# Altium schematic sheet MUX_Block.SchDoc
size A4; SheetNumber: 5; SheetTotal: 7
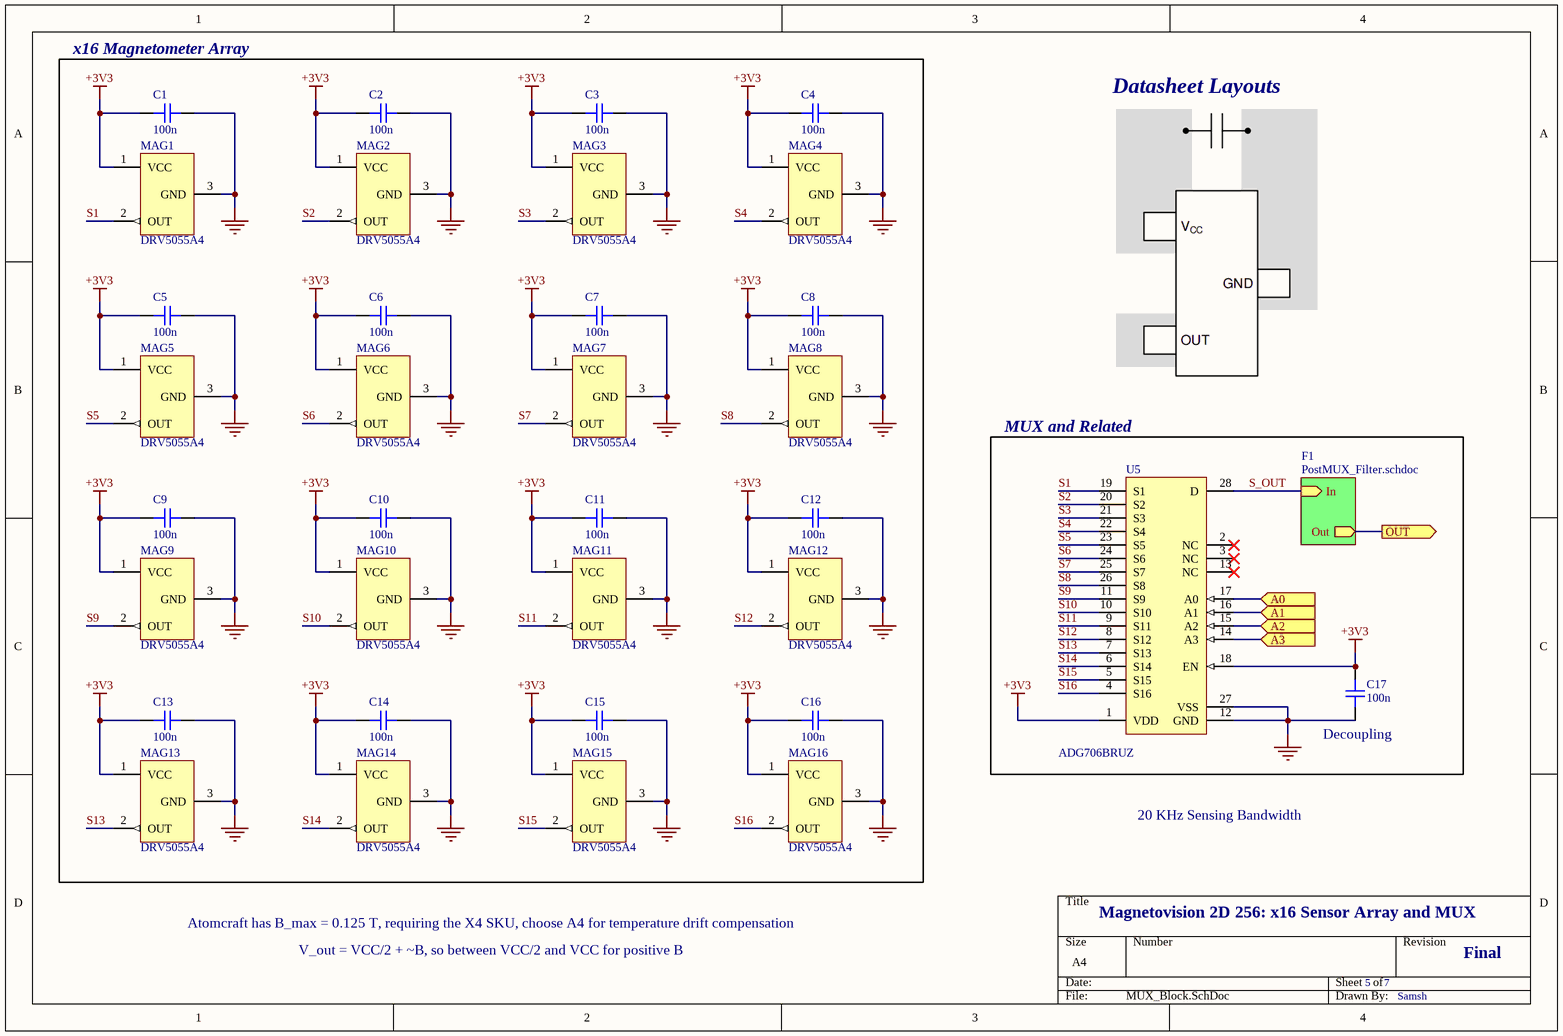
[diagram p0: MUX_Block.SchDoc]

## Parts
C1  100n  [CAP_0603]
C2  100n  [CAP_0603]
C3  100n  [CAP_0603]
C4  100n  [CAP_0603]
C5  100n  [CAP_0603]
C6  100n  [CAP_0603]
C7  100n  [CAP_0603]
C8  100n  [CAP_0603]
C9  100n  [CAP_0603]
C10  100n  [CAP_0603]
C11  100n  [CAP_0603]
C12  100n  [CAP_0603]
C13  100n  [CAP_0603]
C14  100n  [CAP_0603]
C15  100n  [CAP_0603]
C16  100n  [CAP_0603]
C17  100n  [CAP_0603]
MAG1  DRV5055A4  [SOT100P237X112-3N]
MAG2  DRV5055A4  [SOT100P237X112-3N]
MAG3  DRV5055A4  [SOT100P237X112-3N]
MAG4  DRV5055A4  [SOT100P237X112-3N]
MAG5  DRV5055A4  [SOT100P237X112-3N]
MAG6  DRV5055A4  [SOT100P237X112-3N]
MAG7  DRV5055A4  [SOT100P237X112-3N]
MAG8  DRV5055A4  [SOT100P237X112-3N]
MAG9  DRV5055A4  [SOT100P237X112-3N]
MAG10  DRV5055A4  [SOT100P237X112-3N]
MAG11  DRV5055A4  [SOT100P237X112-3N]
MAG12  DRV5055A4  [SOT100P237X112-3N]
MAG13  DRV5055A4  [SOT100P237X112-3N]
MAG14  DRV5055A4  [SOT100P237X112-3N]
MAG15  DRV5055A4  [SOT100P237X112-3N]
MAG16  DRV5055A4  [SOT100P237X112-3N]
U5  ADG706BRUZ  [ADI-RU-28_M]

## Blocks framed on the sheet
x16 Magnetometer Array: C1-C16 MAG1-MAG16
MUX and Related: C17 U5

## Sub-sheets
F1 = PostMUX_Filter.schdoc: In (in), Out (out)

## Ports
A0 (in, see Master[1C]), A1 (in, see Master[1C]), A2 (in, see Master[1C]), A3 (in, see Master[1D]), OUT (out, see Master[1C], PostMUX_Filter[2B])

## Nets
+3V3: C1.1 C2.1 C3.1 C4.1 C5.1 C6.1 C7.1 C8.1 C9.1 C10.1 C11.1 C12.1 C13.1 C14.1 C15.1 C16.1 C17.2 MAG1.1(VCC) MAG2.1(VCC) MAG3.1(VCC) MAG4.1(VCC) MAG5.1(VCC) MAG6.1(VCC) MAG7.1(VCC) MAG8.1(VCC) MAG9.1(VCC) MAG10.1(VCC) MAG11.1(VCC) MAG12.1(VCC) MAG13.1(VCC) MAG14.1(VCC) MAG15.1(VCC) MAG16.1(VCC) U5.1(VDD) U5.18(EN)
GND: C1.2 C2.2 C3.2 C4.2 C5.2 C6.2 C7.2 C8.2 C9.2 C10.2 C11.2 C12.2 C13.2 C14.2 C15.2 C16.2 C17.1 MAG1.3(GND) MAG2.3(GND) MAG3.3(GND) MAG4.3(GND) MAG5.3(GND) MAG6.3(GND) MAG7.3(GND) MAG8.3(GND) MAG9.3(GND) MAG10.3(GND) MAG11.3(GND) MAG12.3(GND) MAG13.3(GND) MAG14.3(GND) MAG15.3(GND) MAG16.3(GND) U5.12(GND) U5.27(VSS)
A0: U5.17(A0) ; port A0
A1: U5.16(A1) ; port A1
A2: U5.15(A2) ; port A2
A3: U5.14(A3) ; port A3
OUT: port OUT, sheet F1/Out
S1: MAG1.2(OUT) U5.19(S1)
S2: MAG2.2(OUT) U5.20(S2)
S3: MAG3.2(OUT) U5.21(S3)
S4: MAG4.2(OUT) U5.22(S4)
S5: MAG5.2(OUT) U5.23(S5)
S6: MAG6.2(OUT) U5.24(S6)
S7: MAG7.2(OUT) U5.25(S7)
S8: MAG8.2(OUT) U5.26(S8)
S9: MAG9.2(OUT) U5.11(S9)
S10: MAG10.2(OUT) U5.10(S10)
S11: MAG11.2(OUT) U5.9(S11)
S12: MAG12.2(OUT) U5.8(S12)
S13: MAG13.2(OUT) U5.7(S13)
S14: MAG14.2(OUT) U5.6(S14)
S15: MAG15.2(OUT) U5.5(S15)
S16: MAG16.2(OUT) U5.4(S16)
S_OUT: U5.28(D) ; sheet F1/In

Not connected (* = marked no-connect by the designer): U5 2(NC)* 3(NC)* 13(NC)*

## Notes on the sheet
- Datasheet Layouts
- (near C17) Decoupling
- 20 KHz Sensing Bandwidth
- Atomcraft has B_max = 0.125 T, requiring the X4 SKU, choose A4 for temperature drift compensation
- Magnetovision 2D 256: x16 Sensor Array and MUX
- V_out = VCC/2 + ~B, so between VCC/2 and VCC for positive B
- 5
- 7
- Final
- Samsh

## Library data of the parts
C1-C17 = CMP-001-00085-1: Capacitor SMD 0603; Distributor Link: *; LCSC: *; Design Item ID: CAP_0603; Rating: *; Source: Schematic-Lib-PhilsLab.SchLib; Manufacturer Part Number: *; Manufacturer: *; Dielectric: *
MAG1-MAG16 = CMP-010-00024-4: Hall Effect Sensor, 176mT Min, -1-1mA, Plastic/epoxy, Rectangular, 3 Pin, Surface Mount, DRV5055A4QDBZR; Nominal Supply Current: 6mA; Output Current: 1mA; Sensor Type: MAGNETIC FIELD SENSOR,HALL EFFECT; Max Supply Voltage: 7V; Nominal Supply Voltage: 5V; Min Supply Voltage: -300mV; Max Operating Temperature: 125°C; Pins: 3; RoHS Compliant: Yes; Mounting Technology: SMD; Case/Package: SOT-23; Min Operating Temperature: -40°C
U5 = CMP-0798-00221-1: 1.8 to 5.5 V / 2.5 V, CMOS Low-Voltage 2.5 Ohm, 16-Channel Multiplexer, -40 to 85 degC, 28-pin SOP (RU-28), Reel; Manufacturer: Analog Devices; PartNumber: ADG706BRUZ-REEL7; t transition (s): 40n; Bandwidth (Hz): 25M; Max Analog Signal Range: Vss to Vdd; Supply V Guar Performance: Dual_(+/-2.5V), Single_(+3V), Single_(+5V); Ron (ohms): 2.5; ComponentLink2URL: http://www.analog.com/static/imported-files/data_sheets/ADG706_707.pdf; PackageVersion: Mar-05; DatasheetVersion: Rev. A; Mounting Technology: Surface Mount; ComponentLink3URL: http://www.analog.com/static/imported-files/packages/249854663RU_28.pdf; Packing: Reel; PackageDescription: 28-Pin Thin Shrink Small Outline Package, Body 9.7 x 4.4 mm, Pitch 0.65 mm; ComponentLink1URL: http://www.analog.com/en/index.html; PackageReference: RU-28; ComponentLink2Description: Datasheet; ComponentLink1Description: Manufacturer URL; Code_JEDEC: MO-153-AE; ComponentLink3Description: Package Specification